# Altium project GR_Barillet.PrjPCB
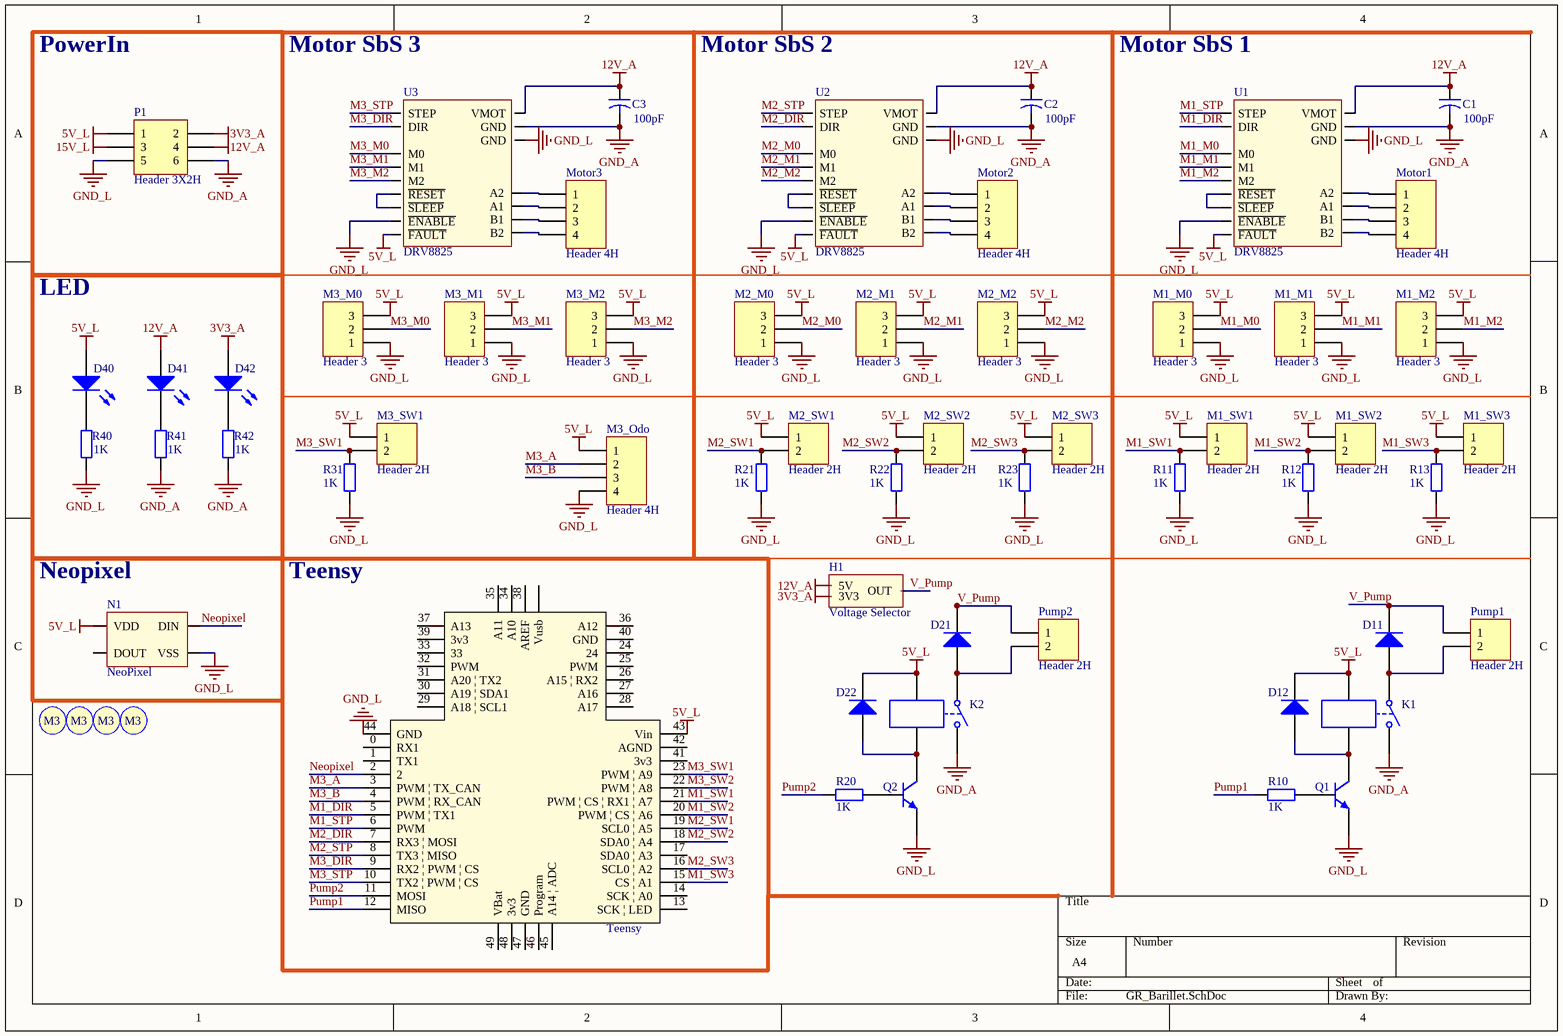
[diagram p0: GR_Barillet.SchDoc]
1 sheet, 59 parts. Net scope: global (net labels, ports and power ports of the same name join across sheets).
Board file: GR_Barillet.PcbDoc

## Sheet GR_Barillet.SchDoc
size A4

### Parts
C1  value 100pF  [Condensateur]  (hidden comment: Cap2)
C2  value 100pF  [Condensateur]  (hidden comment: Cap2)
C3  value 100pF  [Condensateur]  (hidden comment: Cap2)
D11  Diode  [AXIAL-0.3]  (value not drawn)
D12  Diode  [3.2X1.6X1.1]  (value not drawn)
D21  Diode  [AXIAL-0.3]  (value not drawn)
D22  Diode  [3.2X1.6X1.1]  (value not drawn)
D40  LED0  [3.2X1.6X1.1]  (value not drawn)
D41  LED0  [3.2X1.6X1.1]  (value not drawn)
D42  LED0  [3.2X1.6X1.1]  (value not drawn)
H1  Voltage Selector  [VOLTAGE SELECTOR]
K1  Relay-SPST  [Relay]  (value not drawn)
K2  Relay-SPST  [Relay]  (value not drawn)
M1_M0  Header 3  [HDR1X3]
M1_M1  Header 3  [HDR1X3]
M1_M2  Header 3  [HDR1X3]
M1_SW1  Header 2H  [Molex SPOX 2x1H]
M1_SW2  Header 2H  [Molex SPOX 2x1H]
M1_SW3  Header 2H  [Molex SPOX 2x1H]
M2_M0  Header 3  [HDR1X3]
M2_M1  Header 3  [HDR1X3]
M2_M2  Header 3  [HDR1X3]
M2_SW1  Header 2H  [Molex SPOX 2x1H]
M2_SW2  Header 2H  [Molex SPOX 2x1H]
M2_SW3  Header 2H  [Molex SPOX 2x1H]
M3_M0  Header 3  [HDR1X3]
M3_M1  Header 3  [HDR1X3]
M3_M2  Header 3  [HDR1X3]
M3_Odo  Header 4H  [Molex SPOX 4x1H]
M3_SW1  Header 2H  [Molex SPOX 2x1H]
Motor1  Header 4H  [Molex SPOX 4x1H]
Motor2  Header 4H  [Molex SPOX 4x1H]
Motor3  Header 4H  [Molex SPOX 4x1H]
N1  NeoPixel  [Neopixel]
P1  Header 3X2H  [MOLEX_MINIFITJR_3X2]
Pump1  Header 2H  [Molex SPOX 2x1H]
Pump2  Header 2H  [Molex SPOX 2x1H]
Q1  NPN  [TO-226-AA]  (value not drawn)
Q2  NPN  [TO-226-AA]  (value not drawn)
R10  value 1K  [3.2X1.6X1.1]  (hidden comment: Res2)
R11  value 1K  [3.2X1.6X1.1]  (hidden comment: Res1)
R12  value 1K  [3.2X1.6X1.1]  (hidden comment: Res1)
R13  value 1K  [3.2X1.6X1.1]  (hidden comment: Res1)
R20  value 1K  [3.2X1.6X1.1]  (hidden comment: Res2)
R21  value 1K  [3.2X1.6X1.1]  (hidden comment: Res1)
R22  value 1K  [3.2X1.6X1.1]  (hidden comment: Res1)
R23  value 1K  [3.2X1.6X1.1]  (hidden comment: Res1)
R31  value 1K  [3.2X1.6X1.1]  (hidden comment: Res1)
R40  value 1K  [3.2X1.6X1.1]  (hidden comment: Res2)
R41  value 1K  [3.2X1.6X1.1]  (hidden comment: Res2)
R42  value 1K  [3.2X1.6X1.1]  (hidden comment: Res2)
S1  Screw M3  [Screw M3]  (value not drawn)
S2  Screw M3  [Screw M3]  (value not drawn)
S3  Screw M3  [Screw M3]  (value not drawn)
S4  Screw M3  [Screw M3]  (value not drawn)
Teensy  Teensy 3.2  [teensy]  (value not drawn)
U1  DRV8825  [DRV8825]
U2  DRV8825  [DRV8825]
U3  DRV8825  [DRV8825]

### Nets
3V3_A: D42.1(A) H1.2(3V3) P1.2
5V_L: D12.2(K) D22.2(K) D40.1(A) K1.3 K2.3 M1_M0.3 M1_M1.3 M1_M2.3 M1_SW1.1 M1_SW2.1 M1_SW3.1 M2_M0.3 M2_M1.3 M2_M2.3 M2_SW1.1 M2_SW2.1 M2_SW3.1 M3_M0.3 M3_M1.3 M3_M2.3 M3_Odo.1 M3_SW1.1 N1.4(VDD) P1.1 Teensy.43(Vin) U1.10(~{FAULT}) U2.10(~{FAULT}) U3.10(~{FAULT})
12V_A: C1.1 C2.1 C3.1 D41.1(A) H1.1(5V) P1.4 U1.16(VMOT) U2.16(VMOT) U3.16(VMOT)
15V_L: P1.3
GND_A: C1.2 C2.2 C3.2 K1.2 K2.2 P1.6 R41.1 R42.1 U1.15(GND) U2.15(GND) U3.15(GND)
GND_L: M1_M0.1 M1_M1.1 M1_M2.1 M2_M0.1 M2_M1.1 M2_M2.1 M3_M0.1 M3_M1.1 M3_M2.1 M3_Odo.4 N1.2(VSS) P1.5 Q1.3(E) Q2.3(E) R11.1 R12.1 R13.1 R21.1 R22.1 R23.1 R31.1 R40.1 Teensy.44(GND) U1.1(~{ENABLE}) U1.9(GND) U2.1(~{ENABLE}) U2.9(GND) U3.1(~{ENABLE}) U3.9(GND)
M1_DIR: Teensy.5(PWM_|_TX1) U1.8(DIR)
M1_M0: M1_M0.2 U1.2(M0)
M1_M1: M1_M1.2 U1.3(M1)
M1_M2: M1_M2.2 U1.4(M2)
M1_STP: Teensy.6(PWM) U1.7(STEP)
M1_SW1: M1_SW1.2 R11.2 Teensy.21(PWM_|_CS_|_RX1_|_A7)
M1_SW2: M1_SW2.2 R12.2 Teensy.20(PWM_|_CS_|_A6)
M1_SW3: M1_SW3.2 R13.2 Teensy.15(CS_|_A1)
M2_DIR: Teensy.7(RX3_|_MOSI) U2.8(DIR)
M2_M0: M2_M0.2 U2.2(M0)
M2_M1: M2_M1.2 U2.3(M1)
M2_M2: M2_M2.2 U2.4(M2)
M2_STP: Teensy.8(TX3_|_MISO) U2.7(STEP)
M2_SW1: M2_SW1.2 R21.2 Teensy.19(SCL0_|_A5)
M2_SW2: M2_SW2.2 R22.2 Teensy.18(SDA0_|_A4)
M2_SW3: M2_SW3.2 R23.2 Teensy.16(SCL0_|_A2)
M3_A: M3_Odo.2 Teensy.3(PWM_|_TX_CAN)
M3_B: M3_Odo.3 Teensy.4(PWM_|_RX_CAN)
M3_DIR: Teensy.9(RX2_|_PWM_|_CS) U3.8(DIR)
M3_M0: M3_M0.2 U3.2(M0)
M3_M1: M3_M1.2 U3.3(M1)
M3_M2: M3_M2.2 U3.4(M2)
M3_STP: Teensy.10(TX2_|_PWM_|_CS) U3.7(STEP)
M3_SW1: M3_SW1.2 R31.2 Teensy.23(PWM_|_A9)
M3_SW2: Teensy.22(PWM_|_A8)
Neopixel: N1.3(DIN) Teensy.2
Pump1: R10.1 Teensy.12(MISO)
Pump2: R20.1 Teensy.11(MOSI)
V_Pump: D11.2(K) D21.2(K) H1.3(OUT) Pump1.1 Pump2.1
NetD11_1: D11.1(A) K1.1 Pump1.2
NetD12_1: D12.1(A) K1.4 Q1.1(C)
NetD21_1: D21.1(A) K2.1 Pump2.2
NetD22_1: D22.1(A) K2.4 Q2.1(C)
NetD40_2: D40.2(K) R40.2
NetD41_2: D41.2(K) R41.2
NetD42_2: D42.2(K) R42.2
NetMotor1_1: Motor1.1 U1.11(A2)
NetMotor1_2: Motor1.2 U1.12(A1)
NetMotor1_3: Motor1.3 U1.13(B1)
NetMotor1_4: Motor1.4 U1.14(B2)
NetMotor2_1: Motor2.1 U2.11(A2)
NetMotor2_2: Motor2.2 U2.12(A1)
NetMotor2_3: Motor2.3 U2.13(B1)
NetMotor2_4: Motor2.4 U2.14(B2)
NetMotor3_1: Motor3.1 U3.11(A2)
NetMotor3_2: Motor3.2 U3.12(A1)
NetMotor3_3: Motor3.3 U3.13(B1)
NetMotor3_4: Motor3.4 U3.14(B2)
NetQ1_2: Q1.2(B) R10.2
NetQ2_2: Q2.2(B) R20.2
NetU1_5: U1.5(~{RESET}) U1.6(~{SLEEP})
NetU2_5: U2.5(~{RESET}) U2.6(~{SLEEP})
NetU3_5: U3.5(~{RESET}) U3.6(~{SLEEP})

Not connected (* = marked no-connect by the designer): N1 1(DOUT); Teensy 0(RX1) 1(TX1) 13(SCK_|_LED) 14(SCK_|_A0) 17(SDA0_|_A3) 24 25(PWM) 26(A15_|_RX2) 27(A16) 28(A17) 29(A18_|_SCL1) 30(A19_|_SDA1) 31(A20_|_TX2) 32(PWM) 33 34(A10) 35(A11) 36(A12) 37(A13) 38(AREF) 39(3v3) 40(GND) 41(3v3) 42(AGND) 45(A14_|_ADC) 46(Program) 47(GND) 48(3v3) 49(VBat) 50(Vusb)

### Notes on the sheet
- PowerIn
- Motor SbS 3
- Motor SbS 2
- Motor SbS 1
- LED
- (near N1) Neopixel
- (near Teensy) Teensy
- (in symbol Screw M3) M3

### Library data of the parts
C1-C3 = Cap2: Capacitor; Published: 23-Sep-2002; PackageReference: CAPR5-4X5; Publisher: Altium Limited; PackageDescription: Capacitor; 2 Leads
D11 D12 D21 D22 = Diode: Default Diode; Published: 8-Jun-2000; LatestRevisionDate: 17-Jul-2002; LatestRevisionNote: Re-released for DXP Platform.; PackageVersion: Sep-1996; PackageReference: SMC; Publisher: Altium Limited; PackageDescription: DO-214-AB/SMC; 2 C-Bend Leads; Body 7.9 x 5.9 mm, inc. leads (LxW); Code_JEDEC: DO-214-AB
D40-D42 = LED0: Typical INFRARED GaAs LED; Published: 8-Jun-2000; LatestRevisionDate: 08-Jul-2005; LatestRevisionNote: Mech Layer 1 removed.; PackageReference: LED-0; Publisher: Altium Limited; PackageDescription: LED; 2 Leads
H1 = Voltage Selector: Selection of voltage by soldering pads
K1 K2 = Relay-SPST: Single-Pole Single-Throw Relay; Published: 24-Mar-1999; LatestRevisionDate: 17-Jul-2002; LatestRevisionNote: Re-released for DXP Platform.; PackageReference: MODULE4; Publisher: Altium Limited
M1_M0-M1_M2 M2_M0-M2_M2 M3_M0-M3_M2 = Header 3: Header, 3-Pin; LatestRevisionDate: 17-Jul-2002; LatestRevisionNote: Re-released for DXP Platform.; Publisher: Altium Limited
M1_SW1-M1_SW3 M2_SW1-M2_SW3 M3_SW1 Pump1 Pump2 = Header 2H: Header, 2-Pin, Right Angle; LatestRevisionDate: 17-Jul-2002; LatestRevisionNote: Re-released for DXP Platform.; Publisher: Altium Limited
M3_Odo Motor1-Motor3 = Header 4H: Header, 4-Pin, Right Angle; LatestRevisionDate: 17-Jul-2002; LatestRevisionNote: Re-released for DXP Platform.; Publisher: Altium Limited
N1 = NeoPixel: pin to pad: 1>4 2>1 3>2 4>3
P1 = Header 3X2H: Header, 3-Pin, Dual row, Right Angle; LatestRevisionDate: 17-Jul-2002; LatestRevisionNote: Re-released for DXP Platform.; Publisher: Altium Limited
Q1 Q2 = NPN: NPN Bipolar Transistor; Published: 8-Jun-2000; LatestRevisionDate: 17-Jul-2002; LatestRevisionNote: Re-released for DXP Platform.; PackageReference: TO-226-AA; Publisher: Altium Limited; PackageDescription: TO, Flat Index; 3 In-Line, Axial Leads; Body Dia. 4.8mm; Leads 0.55 x 0.51 mm (max); Code_JEDEC: TO-226-AA
R10-R13 R20-R23 R31 R40-R42 = Res2: Resistor; Published: 8-Jun-2000; LatestRevisionDate: 17-Jul-2002; LatestRevisionNote: Re-released for DXP Platform.; PackageReference: AXIAL-0.4; Publisher: Altium Limited; PackageDescription: Axial Device, Thru-Hole; 2 Leads; 0.4 in Pin Spacing
Teensy = teensy3.2
U1-U3 = DRV8825: Stepper Driver Module